# Altium project PROJECT-CH340T-BREAKOUT.PrjPcb
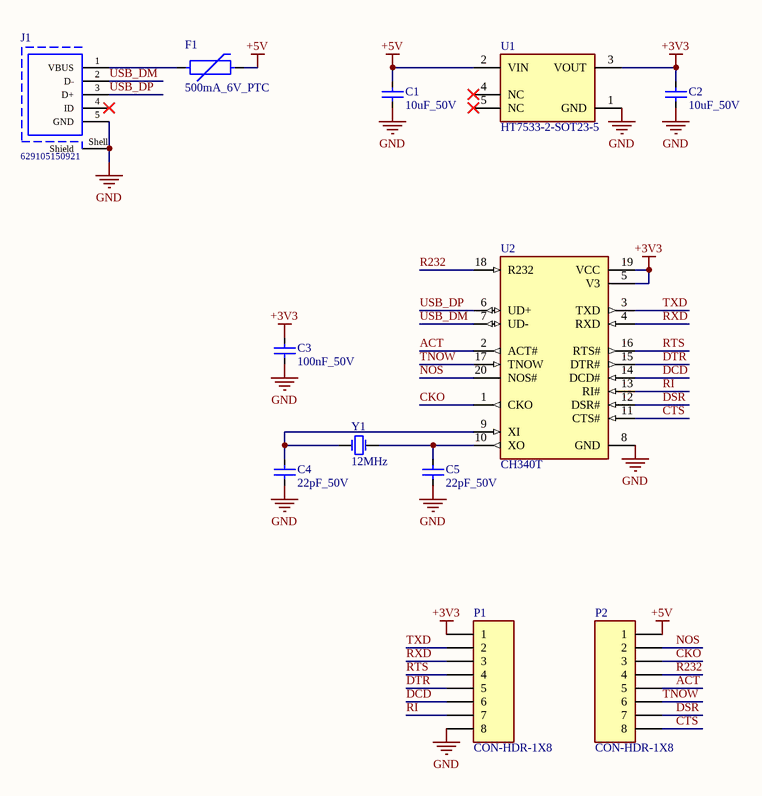
[diagram p0: CH340T-BREAKOUT.SchDoc]
1 sheet, 12 parts. Net scope: global (net labels, ports and power ports of the same name join across sheets).
Board file: CH340T-BREAKOUT.PcbDoc

## Sheet CH340T-BREAKOUT.SchDoc: CH340T Breakout Board
size A4; Author: Meysam Parvizi; DrawnBy: Meysam Parvizi; SheetNumber: 1; SheetTotal: 1

### Parts
C1  value 10uF_50V  [C0805]  (hidden comment: C0805C104K5RAC7411)
C2  value 10uF_50V  [C0805]  (hidden comment: C0805C104K5RAC7411)
C3  value 100nF_50V  [C0805]  (hidden comment: C0805C104K5RAC7411)
C4  value 22pF_50V  [C0805]  (hidden comment: C0603C220J5GACAUTO)
C5  value 22pF_50V  [C0805]  (hidden comment: C0603C220J5GACAUTO)
F1  value 500mA_6V_PTC  [R0805]  (hidden comment: MF-PSMF050X-2)
J1  629105150921  [CON-MICRO-USB-B-SMD-WITH-HOLDER]
P1  CON-HDR-1X8  [CON-HDR-1X8-2.54]
P2  CON-HDR-1X8  [CON-HDR-1X8-2.54]
U1  HT7533-2-SOT23-5  [SOT-23-5]
U2  CH340T  [SSOP-20]
Y1  12MHz  [HC-49-US-TH]

### Nets
+3V3: C2.1 C3.1 P1.1 U1.3(VOUT) U2.5(V3) U2.19(VCC)
+5V: C1.1 F1.2 P2.1 U1.2(VIN)
GND: C1.2 C2.2 C3.2 C4.2 C5.2 J1.5(GND) J1.Shell(Shield) P1.8 U1.1(GND) U2.8(GND)
ACT: P2.5 U2.2(ACT#)
CKO: P2.3 U2.1(CKO)
CTS: P2.8 U2.11(CTS#)
DCD: P1.6 U2.14(DCD#)
DSR: P2.7 U2.12(DSR#)
DTR: P1.5 U2.15(DTR#)
NOS: P2.2 U2.20(NOS#)
R232: P2.4 U2.18(R232)
RI: P1.7 U2.13(RI#)
RTS: P1.4 U2.16(RTS#)
RXD: P1.3 U2.4(RXD)
TNOW: P2.6 U2.17(TNOW)
TXD: P1.2 U2.3(TXD)
USB_DM: J1.2(D-) U2.7(UD-)
USB_DP: J1.3(D+) U2.6(UD+)
NetC4_1: C4.1 U2.9(XI) Y1.1
NetC5_1: C5.1 U2.10(XO) Y1.2
NetF1_1: F1.1 J1.1(VBUS)

Not connected (* = marked no-connect by the designer): J1 4(ID)*; U1 4(NC)* 5(NC)*

### Notes on the sheet
- Title:
- Designed By:
- Meysam Parvizi
- GitHub:
- https://github.com/m3y54m
- File:
- Project Git Hash:
- Project:
- Date:
- Sheet
- Revision:
- of
- Size:
- A4
- File Git Hash:

### Library data of the parts
C1-C3 = CAPACITOR: C0805 0.10 μF X7R 30ppm/°C 10.00% 50 V; Manufacturer: KEMET; Material: Ceramic; Tolerance: 0.1; Capacitance: 100nF; Voltage Rating: 50 V; Temperature: -55°C to +125°C; Device Class L3: Ceramic Capacitors; Temperature Characteristic: X7R; Device Class L1: Passive Components; Category: Cap; Temperature Coefficient: 30ppm/°C; Manufacturer Part Number: C0805C104K5RAC7411; Temperature Range High: +125°C; Height: 0.88mm; RoHS: TRUE; ComponentLink2Description: Datasheet; Lead Free: Yes; Package: C0805C-DN; Temperature Range Low: -55°C; ComponentLink2URL: https://content.kemet.com/datasheets/KEM_C1003_C0G_SMD.pdf; Automotive: No; Ipc Land Pattern Name: CAPC200125X78; Octopart: https://octopart.com/c0805c104k5rac7411-kemet-18508045; Device Class L2: Capacitors
C4 C5 = CAPACITOR: Cap Ceramic 22pF 50V C0G 5% SMD 0603; ComponentLink2Description: Datasheet; ComponentLink2URL: https://content.kemet.com/datasheets/KEM_C1003_C0G_SMD.pdf
F1 = FUSE-PTC: FUSE 500MA SMD (0805) RESETABLE
J1 = CON-MICRO-USB-AB-RCPT-SMD: Micro USB 2.0 Type AB Receptacle WR-COM, Horizontal, SMT; Manufacturer: Wurth Elektronik; Rated Current: 1.8A; Contact Resistance: 30mOhm; Working Voltage: 30VAC; Publisher: WurthElektronik; Part Number: 629105150921; Operating Temperature: -40to85degC; Gender: Receptacle; Packaging: TapeandReel; Connector Type: MicroUSB2.0TypeAB; Datasheet URL: https://katalog.we-online.de/em/datasheet/629105150921.pdf; Mounting Technology: SMT; Orientation: Horizontal; Package Reference: 629105150921; Manufacturer URL: http://www.we-online.de
P1 P2 = CON-HDR-1X8: Pin Header, 8-Pin; LatestRevisionDate: 17-Jul-2002; LatestRevisionNote: Re-released for DXP Platform.; Publisher: Altium Limited
U1 = HT7533-2-SOT23-5: 100mA 55mV@(1mA) Fixed 3.3V~3.3V Positive 1 30V SOT-23-5 Linear Voltage Regulators (LDO) ROHS
U2 = CH340T: CH340 USB 2.0 to UART Interface Evaluation Board; MF: Olimex LTD; Package: None; SnapEDA_Link: https://www.snapeda.com/parts/CH340T/Olimex%20LTD/view-part/105740/?ref=snap; MP: CH340T; Value: *; Availability: Unavailable; Price: None
Y1 = CRYSTAL-2P: CRYSTAL 8.0000MHZ 18PF SMD; ESR (Equivalent Series Resistance): 80R; Operating Frequency: 8 MHz; Frequency Stability: 50ppm; Tolerance: 20ppm; Frequency: 8MHz; Min Operating Temperature: -20°C; Lead Free: Lead Free; Width: 4.7mm; Packaging: Tape and Reel; Series: ABLS; Accuracy: 20ppm; Length: 11.4mm; Frequency Tolerance: 20ppm; Termination: SMD/SMT; Number of Pins: 2; Radiation Hardening: No; Depth: 4.7mm; REACH SVHC: No SVHC; Contact Plating: Tin; Load Capacitance: 18pF; Case/Package: SMD/SMT; Mount: Surface Mount; Package Quantity: 1000; Max Operating Temperature: 70°C; Height: 0.165inch; Series Resistance: 80R